# EAGLE design clock02 (EAGLE 5.01)
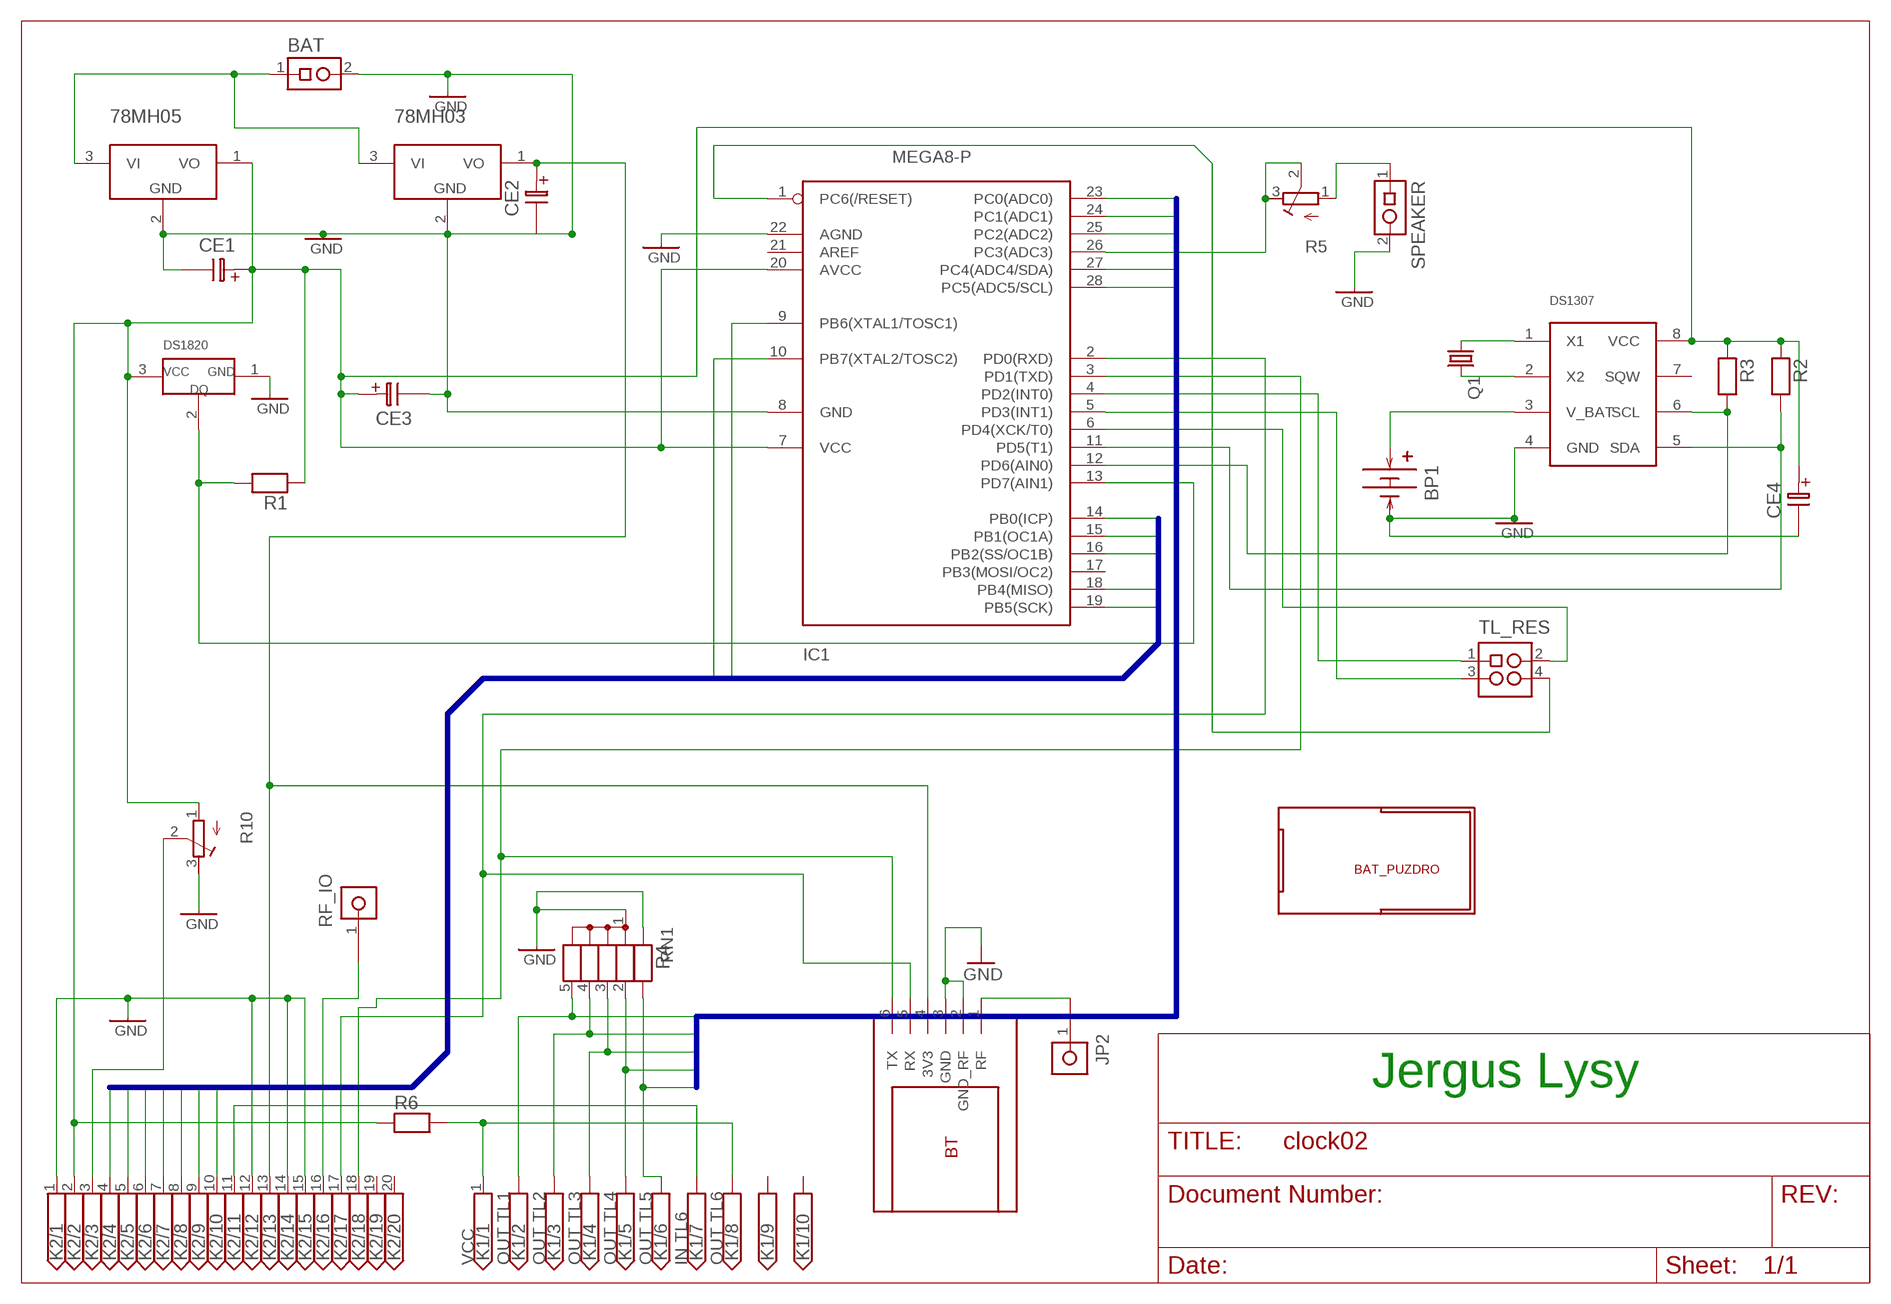
[diagram p0: schematic, sheet 1]

## Parts
78MH03  78LXXZA  [TO-92B]
78MH05  78LXXZA  [TO-92B]
BAT  JUM-1X2  [1X02]
BP1  B_BH2032  [B_BH2032]
CE1  CE-R05_2,5  [CR05_2,5]
CE2  CE-R05_2,5  [CR05_2,5]
CE3  CE-R05_2,5  [CR05_2,5]
CE4  CE-R05_2,5  [CR05_2,5]
DS1307  DS1307  [DIL-08]
DS1820  DS1820  [TO-92B]
IC1  MEGA8-P  [DIL28-3]
JP2  PINHD-1X1  [1X01]
K1  PIN-2X5MLW10G  [LH-10]
K2  PIN-2X10LH  [LH-20]
Q1  CRYSTALTC26V  [TC26V]
R1  R_KLASIK2X10S  [R2_10S]
R2  R_KLASIK2X10S  [R2_10S]
R3  R_KLASIK2X10S  [R2_10S]
R4  R_KLASIK2X10S  [R2_10S]
R5  R-TRIMM74W  [RTRIM74W]
R6  R_KLASIK2X10S  [R2_10S]
R10  R-TRIMM74W  [RTRIM74W]
RF_IO  PINHD-1X1  [1X01]
RN1  RA04  [RN-5]
SPEAKER  JUM-1X2  [1X02]
TL_RES  JUM-2X2  [2X02]
U$10  BAT  [BAT]
U$11  BT_PL  [BT_PL]

## Nets
+: BP1.B+(+) DS1307.3(V_BAT)
GND: 78MH03.2(GND) 78MH05.2(GND) BAT.2 BP1.B-(-) CE1.2(-) CE2.2(-) CE3.2(-) CE4.2(-) DS1307.4(GND) DS1820.1 IC1.8(GND) IC1.22(AGND) K2.1 K2.12 K2.14 K2.15 R4.1 R10.3(A) RN1.1 SPEAKER.2 U$11.2(GND_RF) U$11.3(GND)
N$1: 78MH03.3(VI) 78MH05.3(VI) BAT.1
N$3: IC1.26(PC3(ADC3)) R5.2(S) R5.3(A)
N$4: 78MH03.1(VO) CE2.1(+) K2.13 U$11.4(3V3)
N$5: DS1820.2 IC1.13(PD7(AIN1)) R1.2
N$6: IC1.4(PD2(INT0)) TL_RES.1
N$7: K2.3 R10.2(S)
N$8: IC1.5(PD3(INT1)) TL_RES.3
N$9: DS1307.1(X1) Q1.1
N$10: DS1307.2(X2) Q1.2
N$11: K1.7 K2.11
N$12: K1.1 K1.8 R6.2
N$13: DS1307.6(SCL) IC1.12(PD6(AIN0)) R3.2
N$14: DS1307.5(SDA) IC1.11(PD5(T1)) R2.2
N$15: K2.16 RF_IO.1
N$16: IC1.2(PD0(RXD)) K2.17 U$11.5(RX)
N$17: IC1.3(PD1(TXD)) K2.18 U$11.6(TX)
N$18: IC1.6(PD4(XCK/T0)) TL_RES.2
N$19: IC1.1(PC6(/RESET)) TL_RES.4
N$20: R5.1(E) SPEAKER.1
N$22: JP2.1 U$11.1(RF)
PB0: IC1.14(PB0(ICP)) K2.4
PB1: IC1.15(PB1(OC1A)) K2.5
PB2: IC1.16(PB2(SS/OC1B)) K2.6
PB4: IC1.18(PB4(MISO)) K2.7
PB5: IC1.19(PB5(SCK)) K2.8
PB6: IC1.9(PB6(XTAL1/TOSC1)) K2.9
PB7: IC1.10(PB7(XTAL2/TOSC2)) K2.10
PC0: IC1.23(PC0(ADC0)) K1.2 RN1.5
PC1: IC1.24(PC1(ADC1)) K1.3 RN1.4
PC2: IC1.25(PC2(ADC2)) K1.4 RN1.3
PC4: IC1.27(PC4(ADC4/SDA)) K1.5 RN1.2
PC5: IC1.28(PC5(ADC5/SCL)) K1.6 R4.2
VCC: 78MH05.1(VO) CE1.1(+) CE3.1(+) CE4.1(+) DS1307.8(VCC) DS1820.3 IC1.7(VCC) IC1.20(AVCC) K2.2 R1.1 R2.1 R3.1 R6.1 R10.1(E)
Unconnected: DS1307.7(SQW) IC1.17(PB3(MOSI/OC2)) IC1.21(AREF) K1.9 K1.10 K2.19 K2.20

## Buses
PB0,PB1,PB2,PB3,PB4,PB5,PB6,PB7
PC0,PC1,PC2,PC4,PC5

## Notes on the sheet
- Jergus Lysy
- VCC | OUT TL1 | OUT TL2 | OUT TL3 | OUT TL4 | OUT TL5 | IN TL6 | OUT TL6

## Library data of the parts
78MH03 78MH05 = !LINEAR:78LXXZ
BAT SPEAKER = !PINHEAD:JUM-1X2
BP1 = !ELMECH:B_BH2032
CE1-CE4 = !DISCRET:CE-R
DS1307 = _dallas:DS1307
DS1820 = _dallas:DS1820
IC1 = atmel:MEGA8-P: MICROCONTROLLER 8 Kbytes FLASH, 1 kbytes SRAM, 512 bytes EEPROM, USART, 4-channel 10 bit ADC, 2-channel 8 bit ADC Pin compatible with Atmega48, ATMega88, ATMega168 Source: avr.lbr
JP2 RF_IO = !PINHEAD:PINHD-1X1
K1 = !PINHEAD:PIN-2X5
K2 = !PINHEAD:PIN-2X10
Q1 = crystal:CRYSTAL: CRYSTAL
R1-R4 R6 = !DISCRET:R_KLASIK
R5 R10 = rcl:R-TRIMM: Trimm resistor
RN1 = !DISCRET:RA04
TL_RES = !PINHEAD:JUM-2X2
U$10 = _dallas:BAT
U$11 = _dallas:BT_PL

## Net classes
0 default: width 0.5 mm

## Board
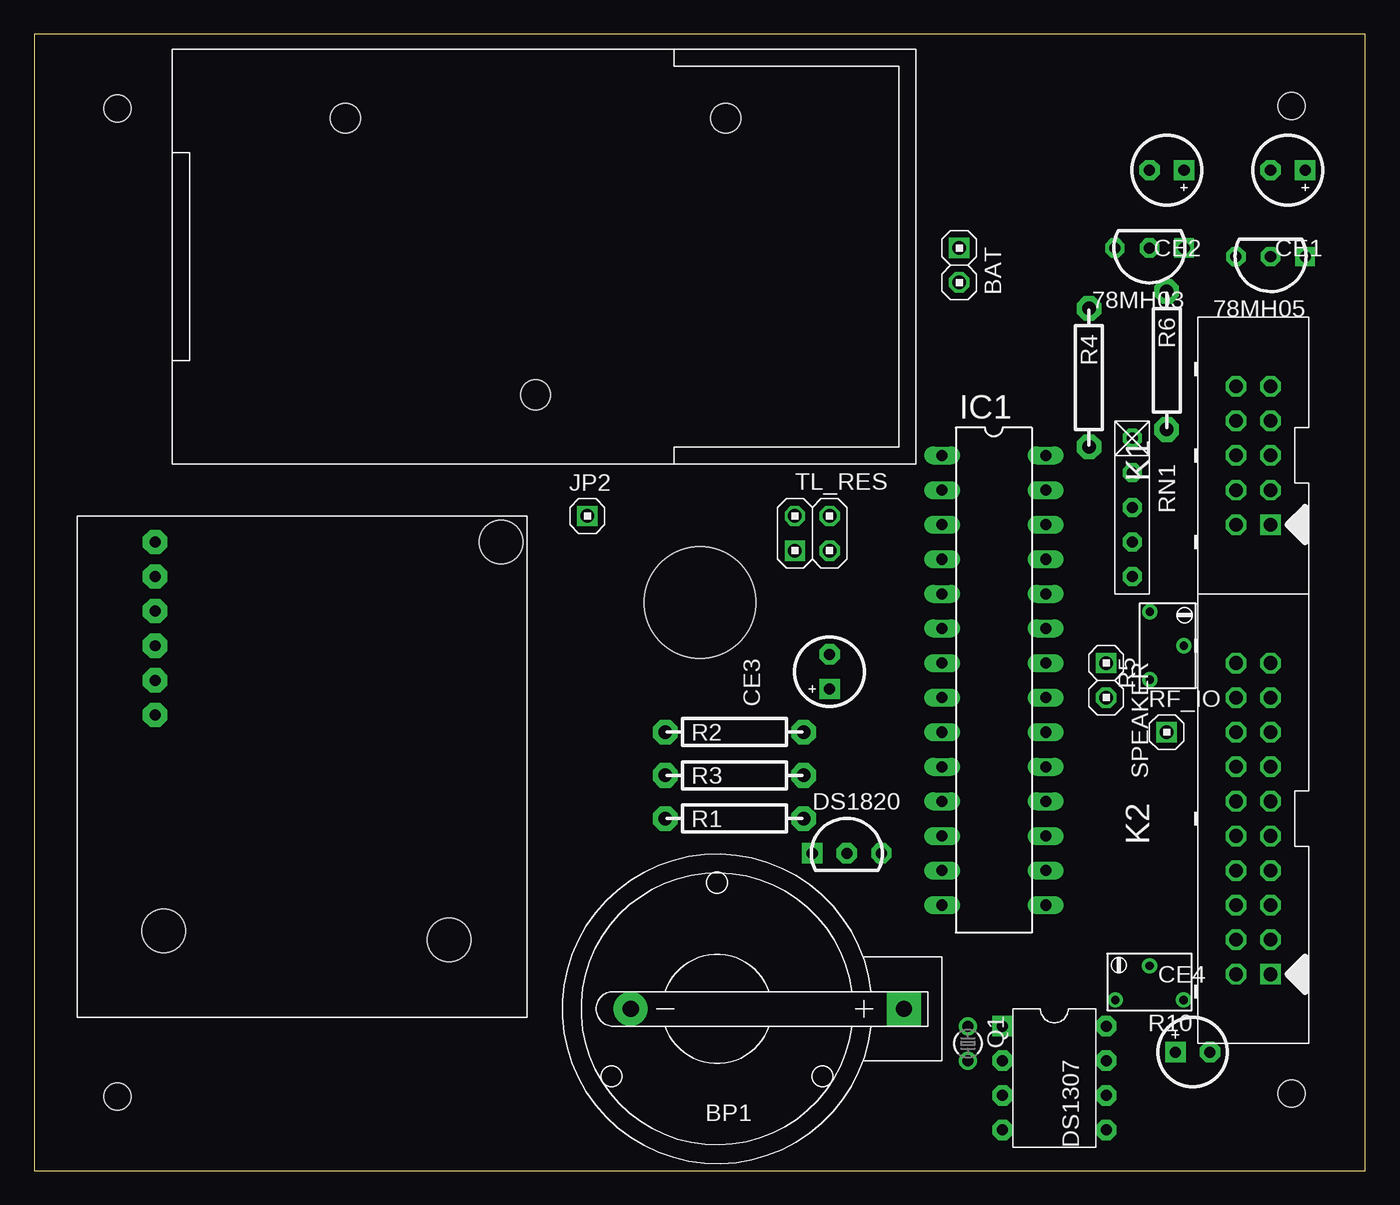
[diagram p1: board, top side]
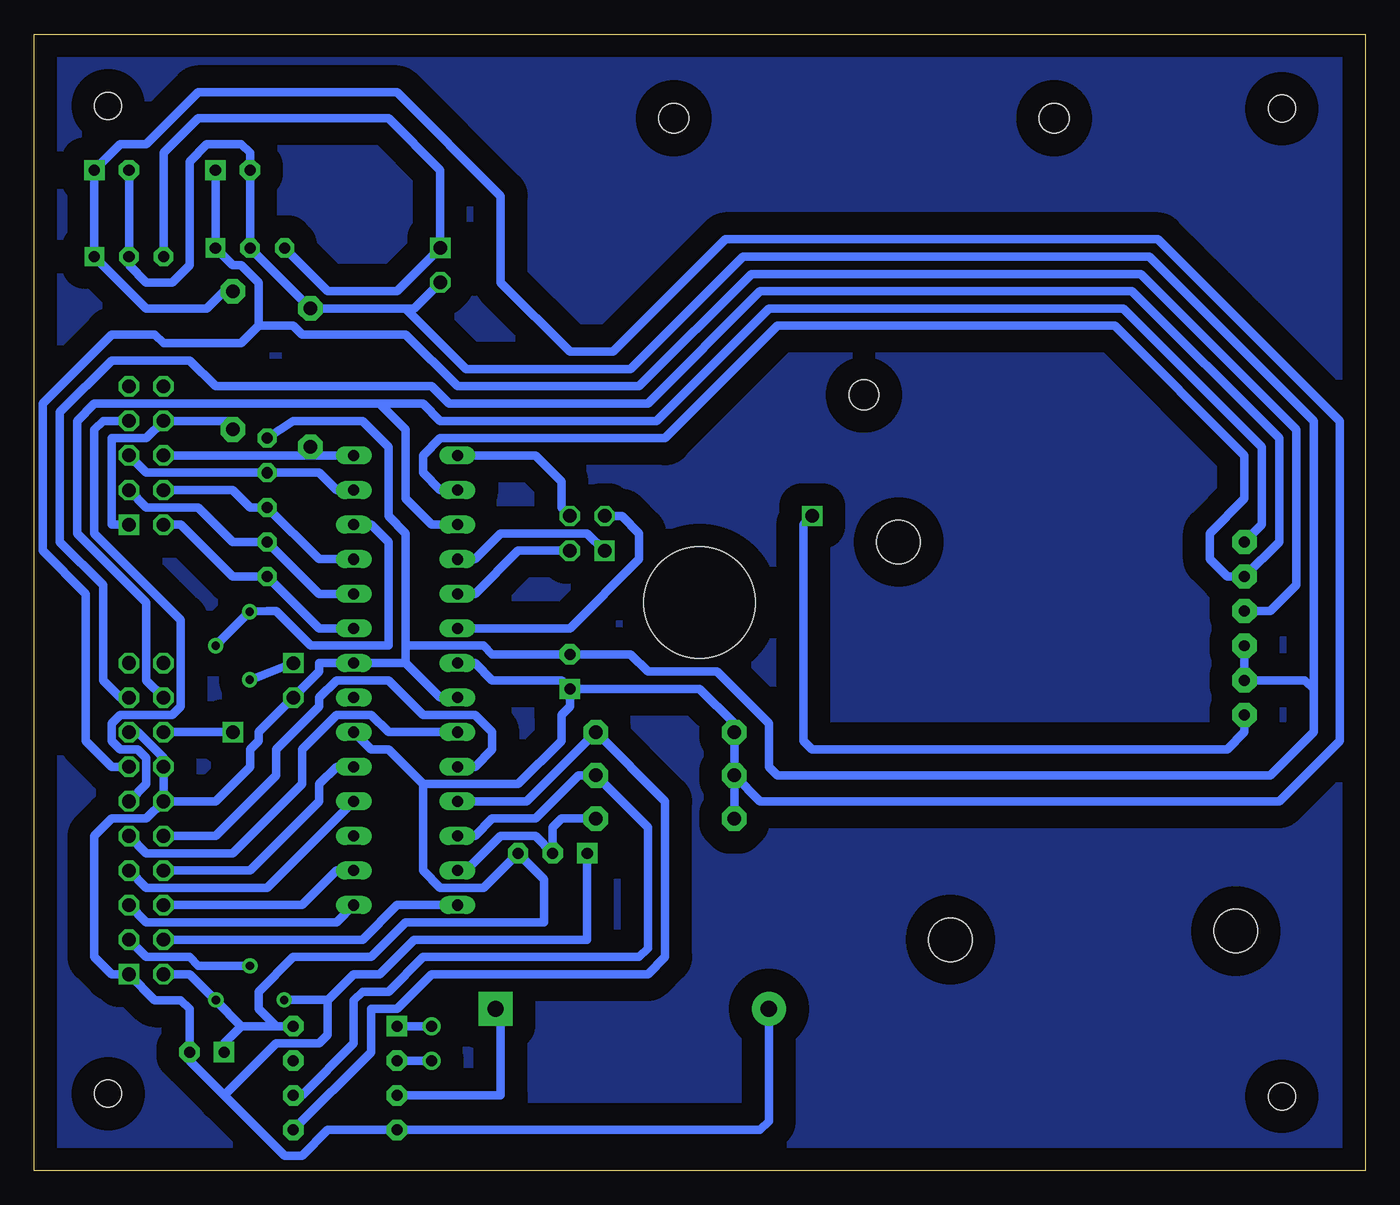
[diagram p2: board, bottom side, seen from below]

Size 97.77 x 83.49 mm. Coordinates in mm from the lower left corner, seen from the top.
Outline: 0,0 97.77,0 97.77,83.49 0,83.49 0,0
Copper layers (1*16): Top 0.035mm / dielectric 1.5mm / Bottom 0.035mm
Design rules "default *": minimum track width 10mil, minimum drill 24mil, track to track 8mil, track to pad 8mil, pad to pad 8mil, via to via 8mil, smd to smd 8mil, copper to edge 40mil, drill to drill 8mil, minimum pad ring 10mil, minimum via ring 8mil, stop-mask expansion 4mil, vias tented up to drill 0mil, thermal gap 10mil
Holes 8.2 mm at 48.89,41.74
Holes 2 mm at 6.13,5.47 6.13,78.02 92.33,5.67 92.33,78.22

### Footprints (pad centres in the part's own frame; a part is rotated, then mirrored left to right if it is on the bottom)
TO-92B = drill 0.813 pad 1.422 square: 1 -2.54,0 | drill 0.813 pad 1.422 octagon: 2 0,0; 3 2.54,0
1X02 = drill 0.991 pad 1.499 square: 1 -1.27,0 | drill 0.991 pad 1.499 octagon: 2 1.27,0
B_BH2032 = drill 1.2 pad 2.5 square: B+ -13.716,0 | drill 1.2 pad 2.5 round: B- 6.35,0
CR05_2,5 = drill 0.813 pad 1.499 square: 1 -1.27,0 | drill 0.813 pad 1.499 octagon: 2 1.27,0
DIL-08 = drill 0.813 pad 1.499 square: 1 -3.81,-3.81 | drill 0.813 pad 1.499 octagon: 2 -1.27,-3.81; 3 1.27,-3.81; 4 3.81,-3.81; 5 3.81,3.81; 6 1.27,3.81; 7 -1.27,3.81; 8 -3.81,3.81
TO-92B' = drill 0.813 pad 1.499 square: 1 -2.54,0 | drill 0.813 pad 1.499 octagon: 2 0,0; 3 2.54,0
DIL28-3 = drill 0.813 long: 1 -16.51,-3.81; 2 -13.97,-3.81; 3 -11.43,-3.81; 4 -8.89,-3.81; 5 -6.35,-3.81; 6 -3.81,-3.81; 7 -1.27,-3.81; 8 1.27,-3.81; 9 3.81,-3.81; 10 6.35,-3.81; 11 8.89,-3.81; 12 11.43,-3.81; 13 13.97,-3.81; 14 16.51,-3.81; 15 16.51,3.81; 16 13.97,3.81; 17 11.43,3.81; 18 8.89,3.81; 19 6.35,3.81; 20 3.81,3.81; 21 1.27,3.81; 22 -1.27,3.81; 23 -3.81,3.81; 24 -6.35,3.81; 25 -8.89,3.81; 26 -11.43,3.81; 27 -13.97,3.81; 28 -16.51,3.81
1X01 = drill 0.991 pad 1.499 square: 1 0,0
LH-10 = drill 0.991 pad 1.499 square: 1 -5.08,-1.27 | drill 0.991 pad 1.499 octagon: 2 -5.08,1.27; 3 -2.54,-1.27; 4 -2.54,1.27; 5 0,-1.27; 6 0,1.27; 7 2.54,-1.27; 8 2.54,1.27; 9 5.08,-1.27; 10 5.08,1.27
LH-20 = drill 1 pad 1.499 square: 1 -11.43,-1.27 | drill 1 pad 1.499 octagon: 2 -11.43,1.27; 3 -8.89,-1.27; 4 -8.89,1.27; 5 -6.35,-1.27; 6 -6.35,1.27; 7 -3.81,-1.27; 8 -3.81,1.27; 9 -1.27,-1.27; 10 -1.27,1.27; 11 1.27,-1.27; 12 1.27,1.27; 13 3.81,-1.27; 14 3.81,1.27; 15 6.35,-1.27; 16 6.35,1.27; 17 8.89,-1.27; 18 8.89,1.27; 19 11.43,-1.27; 20 11.43,1.27
TC26V = drill 0.813 round: 1 -1.27,0; 2 1.27,0
R2_10S = drill 0.991 pad 1.803 octagon: 1 -5.08,0; 2 5.08,0
RTRIM74W = drill 0.61 round: 1 -1.25,-2.5; 2 1.25,0; 3 -1.25,2.5
RN-5 = drill 0.813 pad 1.397 octagon: 1 -5.08,0; 2 -2.54,0; 3 0,0; 4 2.54,0; 5 5.08,0
2X02 = drill 0.991 pad 1.499 square: 1 -1.27,-1.27 | drill 0.991 pad 1.499 octagon: 2 -1.27,1.27; 3 1.27,-1.27; 4 1.27,1.27
BAT = hole 2.2: 26.67,5.08; 12.7,25.4; 40.64,25.4
BT_PL = drill 0.8 pad 1.778 octagon: 1 14.605,5.715; 2 12.065,5.715; 3 9.525,5.715; 4 6.985,5.715; 5 4.445,5.715; 6 1.905,5.715 | hole 3.2: 1.905,31.115; 30.48,6.35; 31.115,27.305

### Placement (x,y rotation side)
78MH03  81.91,67.78 180 top
78MH05  90.8,67.14 180 top
BAT  67.94,66.51 270 top
BP1  50.16,11.9 180 top
CE1  92.07,73.5 180 top
CE2  83.18,73.5 180 top
CE3  58.41,36.66 90 top
CE4  85.08,8.73 0 top
DS1307  74.92,6.82 270 top
DS1820  DS1820  [TO-92B']  59.69,23.33 0 top
IC1  70.48,36.03 270 top
JP2  40.64,48.09 0 top
K1  89.53,52.54 90 top
K2  89.53,25.87 90 top
Q1  68.57,9.36 270 top
R1  51.43,25.87 0 top
R2  51.43,32.22 0 top
R3  51.43,29.04 0 top
R4  77.46,58.25 270 top
R5  83.18,38.57 0 top
R6  83.18,59.52 270 top
R10  81.91,13.81 90 top
RF_IO  83.18,32.22 0 top
RN1  80.64,48.73 270 top
SPEAKER  78.73,36.03 270 top
TL_RES  57.15,46.82 0 top
U$10  10.16,51.91 0 top
U$11  3.17,48.09 270 top

### Tracks (layer width: path | path; a pad name or v marks a point on that pad's centre or on a via)
+
  Bottom 0.61: BP1.B+ 63.5,11.9 63.5,5.55 DS1307.3
GND
  Bottom 0.61: IC1.8 67.94,34.76 70.48,37.3 | 70.48,37.3 IC1.22 75.56,37.3 | K2.12 89.53,25.87 92.07,25.87 93.34,24.6 93.34,15.71 92.07,14.44 K2.1 88.89,12.54 86.99,12.54 86.35,11.9 CE4.2 86.35,8.09 83.81,5.55 | K2.12 84.45,27.14 81.91,29.68 81.91,30.95 81.27,31.58 81.27,32.22 SPEAKER.2 76.83,36.66 76.83,37.3 75.56,37.3 | K2.12 K2.14 88.26,30.31 90.16,32.22 K2.15 | 75.56,37.3 73.02,37.3 | 70.48,38.57 70.48,37.3 | 70.48,38.57 70.48,46.82 71.75,48.09 71.75,53.17 73.66,55.08 78.73,55.08 RN1.1 | 70.48,38.57 64.77,38.57 64.13,37.94 CE3.2 53.97,37.94 52.7,36.66 47.62,36.66 43.81,32.85 43.81,29.68 43.18,29.04 6.98,29.04 3.8,32.22 3.8,35.39 | DS1820.1 57.15,16.98 69.84,16.98 72.38,14.44 74.29,14.44 76.19,12.54 | 76.19,12.54 76.19,10 76.83,9.36 80,9.36 83.81,5.55 | 83.81,5.55 79.37,1.1 78.1,1.1 76.19,3.01 DS1307.4 44.45,3.01 43.81,3.64 BP1.B- | CE1.2 78MH05.2 90.8,66.51 89.53,65.24 87.62,65.24 86.35,66.51 86.35,74.13 85.08,75.4 82.55,75.4 81.91,74.77 CE2.2 78MH03.2 R4.1 70.48,63.34 | R10.3 76.21,12.56 76.19,12.54 | 70.48,63.34 66.03,58.89 53.97,58.89 45.72,67.14 15.87,67.14 3.8,55.08 3.8,35.39 | U$11.3 U$11.2 4.44,36.03 3.8,35.39 | 70.48,63.34 69.84,63.34 BAT.2
N$1
  Bottom 0.61: 78MH05.3 88.26,74.77 85.72,77.3 71.75,77.3 67.94,73.5 BAT.1 71.11,64.61 76.19,64.61 78MH03.3
N$2
  pour Bottom (isolate 1.676): -0.01,83.66 97.78,83.66 97.78,-0.17 -0.01,-0.17
N$3
  Bottom 0.61: IC1.26 73.02,47.46 71.75,46.19 71.75,38.57 77.46,38.57 80,41.11 80.64,41.11 81.93,41.09 | 81.93,41.09 R5.3 | R5.2 84.43,38.59 81.93,41.09
N$4
  Bottom 0.61: K2.13 92.07,29.68 93.97,31.58 93.97,42.38 97.15,45.55 97.15,56.35 92.07,61.43 88.89,61.43 88.26,60.8 82.55,60.8 81.27,62.06 | CE2.1 78MH03.1 83.18,66.51 82.55,66.51 81.27,65.24 81.27,62.06 | 81.27,62.06 78.73,62.06 78.1,61.43 70.48,61.43 66.67,57.62 53.34,57.62 45.08,65.88 16.5,65.88 5.08,54.45 5.08,43.02 6.98,41.11 U$11.4
N$5
  Bottom 0.61: R1.2 59.05,25.87 59.69,25.23 DS1820.2 60.96,24.6 63.5,24.6 66.03,22.06 IC1.13
N$6
  Bottom 0.61: TL_RES.1 57.15,46.82 63.5,46.82 65.4,44.92 IC1.4
N$7
  Bottom 0.61: K2.3 89.53,15.71 86.35,15.71 85.7,15.06 R10.2
N$8
  Bottom 0.61: IC1.5 65.4,42.38 62.23,45.55 TL_RES.3
N$9
  Bottom 0.61: Q1.1 DS1307.1
N$10
  Bottom 0.61: Q1.2 DS1307.2
N$11
  Bottom 0.61: K2.11 89.53,28.41 89.53,30.31 90.16,30.95 91.44,30.95 92.07,31.58 92.07,32.85 91.44,33.49 87.62,33.49 86.99,34.12 86.99,40.48 93.34,46.82 93.34,54.45 92.7,55.08 K1.7
N$12
  Bottom 0.61: K1.1 92.07,47.46 92.07,53.81 89.53,53.81 K1.8 83.18,55.08 R6.2
N$13
  Bottom 0.61: DS1307.6 78.1,5.55 74.29,9.36 74.29,12.54 73.66,13.17 71.75,13.17 69.21,15.71 53.34,15.71 52.7,16.34 52.7,25.23 R3.2 57.78,29.04 60.96,25.87 64.13,25.87 65.4,24.6 IC1.12
N$14
  Bottom 0.61: DS1307.5 73.02,8.73 73.02,11.9 71.11,11.9 68.57,14.44 52.7,14.44 51.43,15.71 51.43,27.14 R2.2 61.59,27.14 IC1.11
N$15
  Bottom 0.61: RF_IO.1 K2.16
N$16
  Bottom 0.61: IC1.2 67.94,50 69.21,51.27 69.21,52.54 67.94,53.81 51.43,53.81 43.18,62.06 18.41,62.06 8.89,52.54 8.89,49.37 11.43,46.82 11.43,44.92 10.16,43.65 U$11.5 6.34,46.19 6.34,53.81 17.14,64.61 44.45,64.61 52.7,56.35 67.3,56.35 68.57,57.62 84.45,57.62 86.35,59.52 92.07,59.52 95.88,55.71 95.88,46.19 92.7,43.02 92.7,36.03 91.44,34.76 K2.17
N$17
  Bottom 0.61: IC1.3 68.57,47.46 70.48,49.37 70.48,54.45 72.38,56.35 | K2.18 89.53,36.03 89.53,41.74 94.61,46.82 94.61,55.08 93.34,56.35 72.38,56.35 | 72.38,56.35 69.21,56.35 67.94,55.08 52.07,55.08 43.81,63.34 17.77,63.34 7.62,53.17 7.62,47.46 U$11.6
N$18
  Bottom 0.61: TL_RES.2 54.61,48.09 53.34,46.82 53.34,44.92 58.41,39.84 IC1.6
N$19
  Bottom 0.61: IC1.1 60.96,52.54 59.05,50.63 59.05,48.73 TL_RES.4
N$20
  Bottom 0.61: R5.1 78.75,37.32 81.91,36.03 SPEAKER.1
N$22
  Bottom 0.61: U$11.1 8.89,32.22 10.16,30.95 40.64,30.95 41.27,31.58 41.27,47.46 JP2.1
PB0
  Bottom 0.61: IC1.14 71.11,19.52 73.66,16.98 K2.4
PB1
  Bottom 0.61: IC1.15 75.56,18.25 89.53,18.25 K2.5
PB2
  Bottom 0.61: K2.6 78.1,19.52 75.56,22.06 IC1.16
PB4
  Bottom 0.61: IC1.18 80.64,20.79 89.53,20.79 K2.7
PB5
  Bottom 0.61: K2.8 81.91,22.06 76.83,27.14 76.83,28.41 75.56,29.68 IC1.19
PB6
  Bottom 0.61: IC1.9 71.75,32.22 73.02,33.49 75.56,33.49 78.1,30.95 78.1,28.41 83.18,23.33 89.53,23.33 K2.9
PB7
  Bottom 0.61: K2.10 84.45,24.6 80,29.04 80,30.95 76.83,34.12 76.83,34.76 75.56,36.03 71.75,36.03 69.21,33.49 65.4,33.49 64.13,32.22 64.13,30.95 65.4,29.68 IC1.10
PC0
  Bottom 0.61: IC1.23 76.83,39.84 RN1.5 83.18,43.65 86.99,47.46 K1.2
PC1
  Bottom 0.61: IC1.24 76.83,42.38 RN1.4 83.18,46.19 85.72,48.73 89.53,48.73 K1.3
PC2
  Bottom 0.61: IC1.25 76.83,44.92 RN1.3 81.91,48.73 83.18,50 K1.4
PC4
  Bottom 0.61: IC1.27 75.56,50 76.83,51.27 RN1.2 89.53,51.27 K1.5
PC5
  Bottom 0.61: IC1.28 77.46,52.54 | 77.46,52.54 K1.6 | 77.46,52.54 R4.2
VCC
  Bottom 0.61: IC1.20 73.02,30.95 71.75,30.95 69.21,28.41 | 69.21,28.41 69.21,22.06 67.94,20.79 64.77,20.79 DS1820.3 60.32,21.42 60.32,18.25 70.48,18.25 73.02,15.71 78.73,15.71 81.27,13.17 81.27,11.9 80,10.63 DS1307.8 82.55,10.63 | CE3.1 58.41,34.12 59.05,33.49 59.05,31.58 62.23,28.41 69.21,28.41 | CE3.1 48.89,35.39 46.35,32.85 R2.1 R3.1 | 82.55,10.63 83.81,9.36 CE4.1 | R3.1 R1.1 | R6.1 83.81,64.61 85.08,63.34 89.53,63.34 78MH05.1 CE1.1 91.44,75.4 89.53,75.4 85.72,79.21 71.11,79.21 63.5,71.59 63.5,65.24 58.41,60.16 55.24,60.16 46.98,68.41 15.24,68.41 1.9,55.08 1.9,31.58 6.34,27.14 44.45,27.14 R3.1 | IC1.7 65.4,37.3 64.13,36.03 59.05,36.03 CE3.1 | 82.55,10.63 84.45,12.54 | 84.45,12.54 84.43,12.56 R10.1 | K2.2 86.35,14.44 84.45,12.54